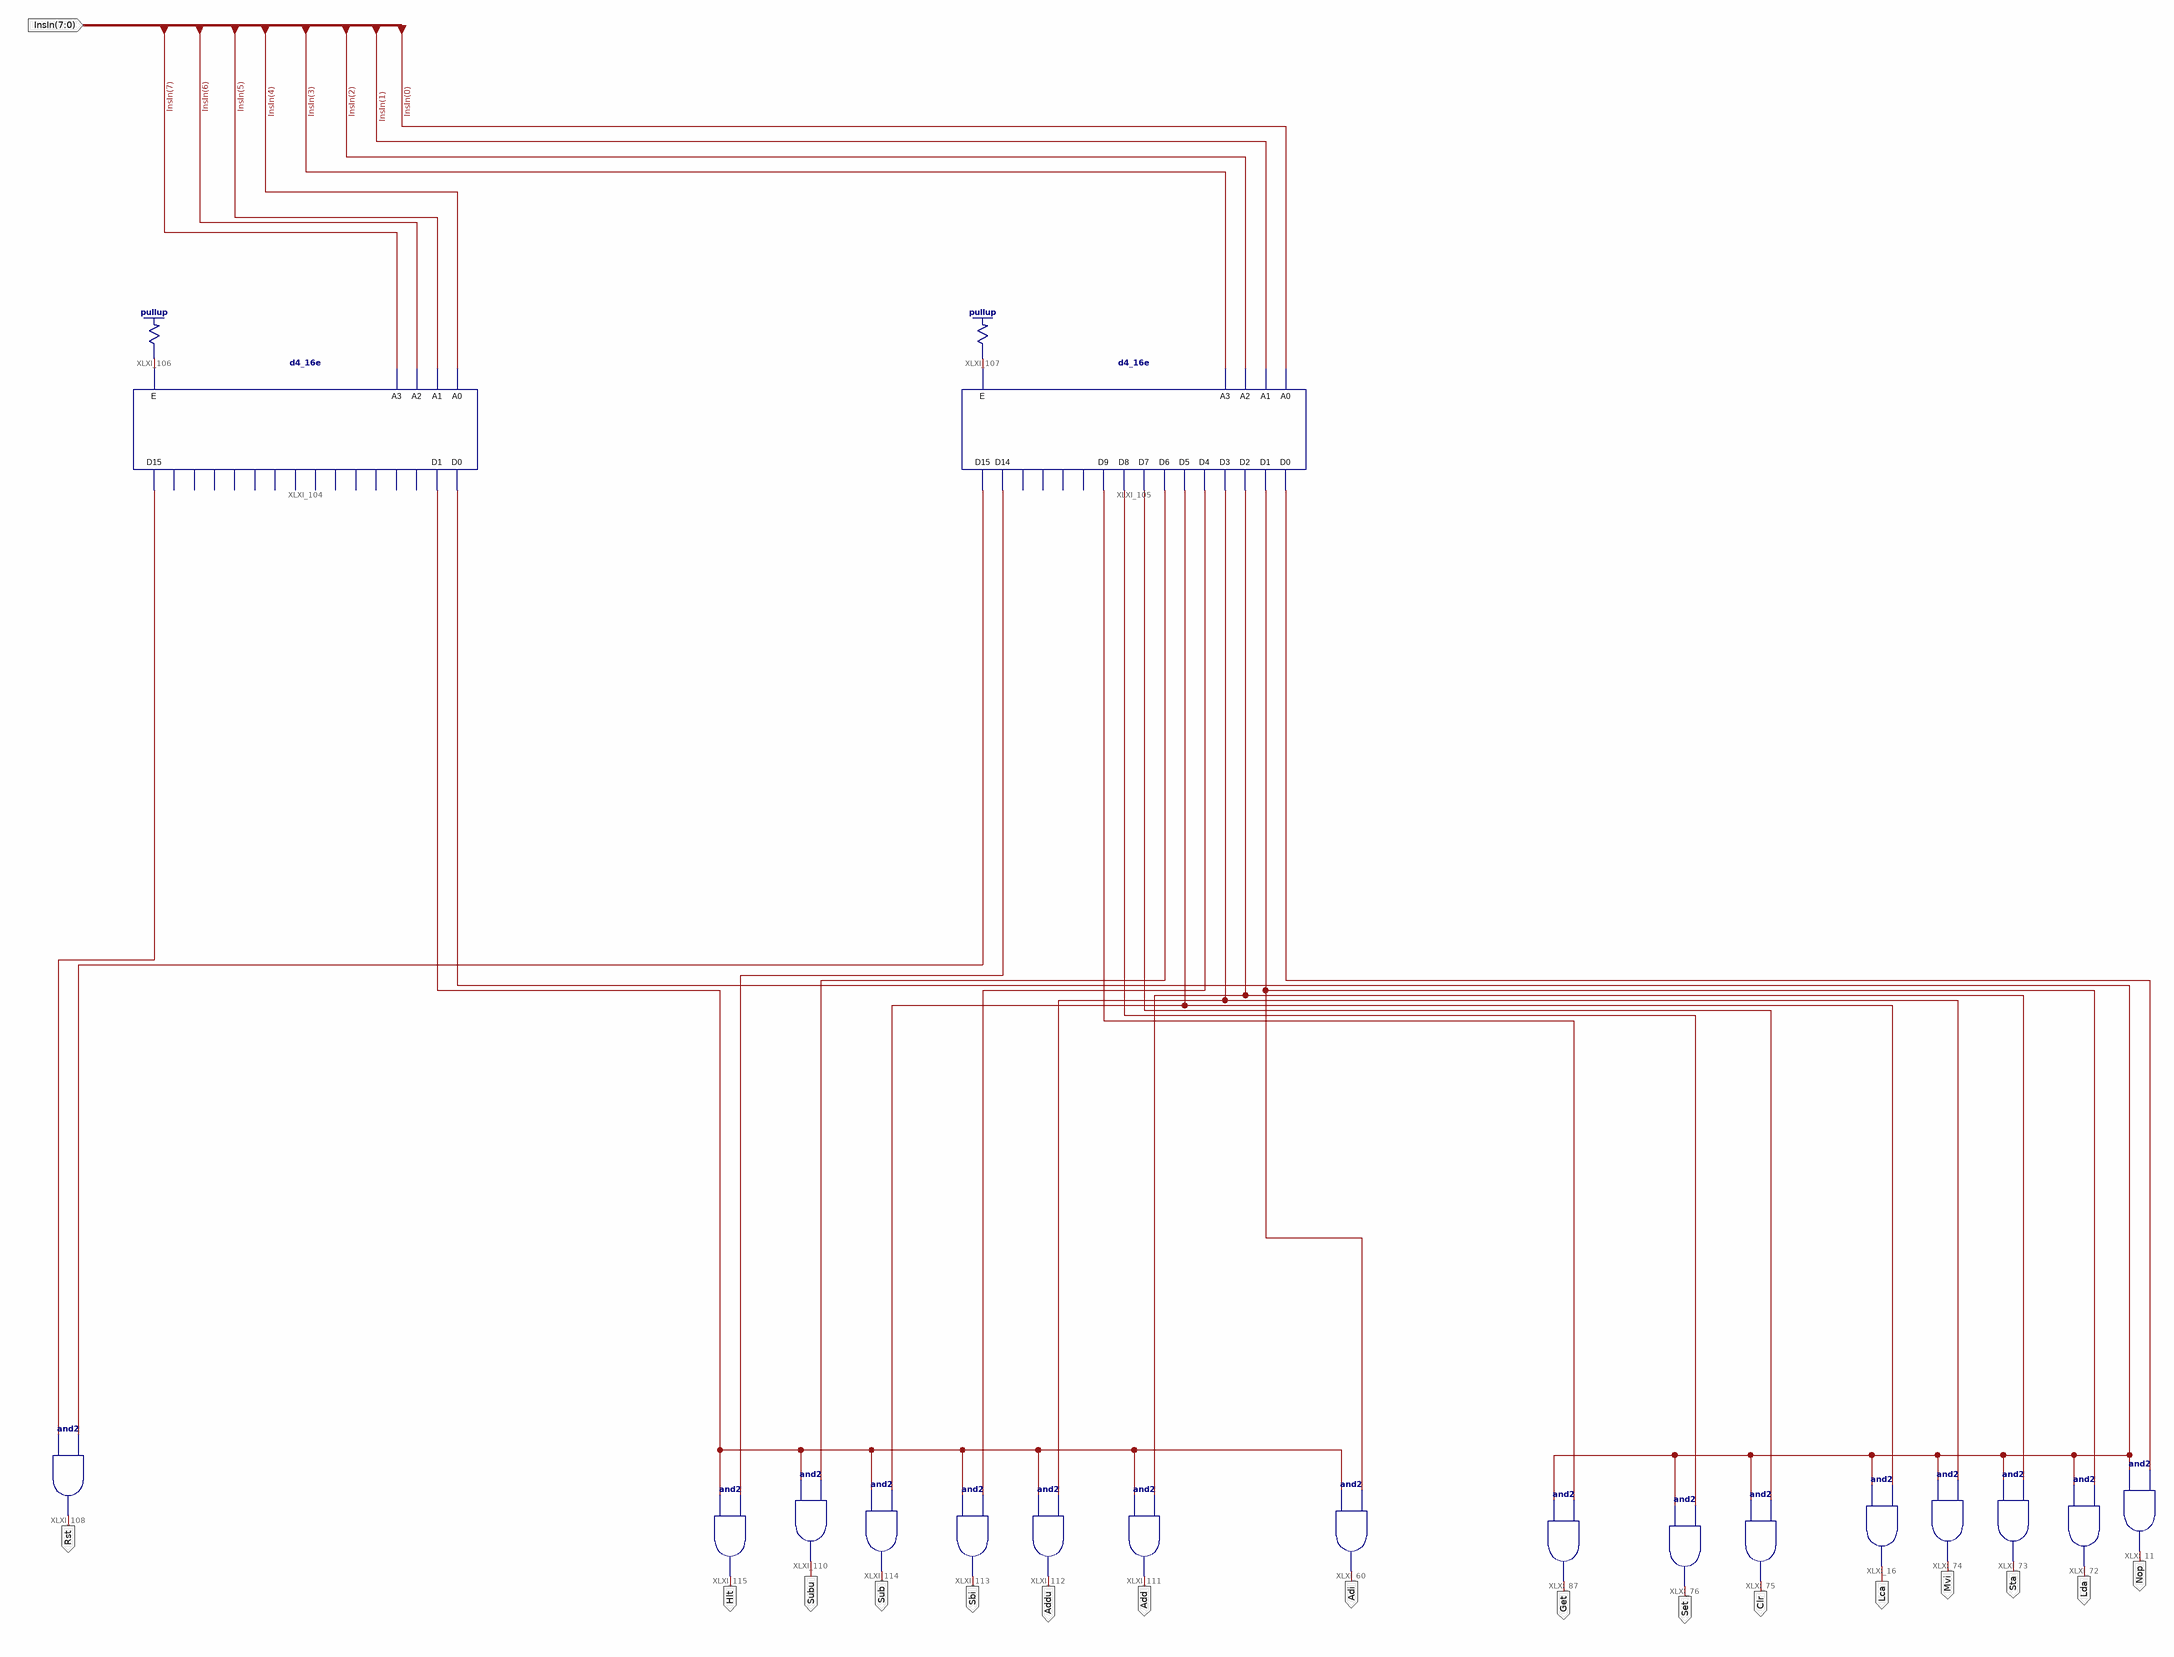
[diagram p0: schematic sheet 1]
// Xilinx ISE schematic InsDecoder.sch (spartan3e) as structural Verilog: 20 symbols, 17 ports
module InsDecoder (
  input  [7:0] InsIn,
  output Rst,
  output Nop,
  output Lca,
  output Lda,
  output Sta,
  output Mvi,
  output Clr,
  output Set,
  output Get,
  output Adi,
  output Add,
  output Addu,
  output Sbi,
  output Sub,
  output Hlt,
  output Subu
);

  wire XLXN_232, XLXN_233, XLXN_238, XLXN_239, XLXN_240, XLXN_241, XLXN_242, XLXN_243, XLXN_244, XLXN_245,
       XLXN_247, XLXN_248, XLXN_249, XLXN_257, XLXN_265, XLXN_266, XLXN_267;

  and XLXI_11 (Nop, XLXN_241, XLXN_240);
  and XLXI_72 (Lda, XLXN_241, XLXN_242);
  and XLXI_73 (Sta, XLXN_241, XLXN_243);
  and XLXI_74 (Mvi, XLXN_241, XLXN_244);
  and XLXI_16 (Lca, XLXN_241, XLXN_245);
  and XLXI_75 (Clr, XLXN_241, XLXN_247);
  and XLXI_76 (Set, XLXN_241, XLXN_248);
  and XLXI_87 (Get, XLXN_241, XLXN_249);
  d4_16e XLXI_104 (
    .A0(InsIn[4]), .A1(InsIn[5]), .A2(InsIn[6]), .A3(InsIn[7]), .E(XLXN_232), .D0(XLXN_241), .D1(XLXN_257),
    .D15(XLXN_238));  // open: D10, D11, D12, D13, D14, D2, D3, D4, D5, D6, D7, D8, D9
  d4_16e XLXI_105 (
    .A0(InsIn[0]), .A1(InsIn[1]), .A2(InsIn[2]), .A3(InsIn[3]), .E(XLXN_233), .D0(XLXN_240), .D1(XLXN_242),
    .D14(XLXN_267), .D15(XLXN_239), .D2(XLXN_243), .D3(XLXN_244), .D4(XLXN_265), .D5(XLXN_245),
    .D6(XLXN_266), .D7(XLXN_247), .D8(XLXN_248), .D9(XLXN_249));  // open: D10, D11, D12, D13
  \pullup  XLXI_106 (.O(XLXN_232));
  \pullup  XLXI_107 (.O(XLXN_233));
  and XLXI_108 (Rst, XLXN_238, XLXN_239);
  and XLXI_60 (Adi, XLXN_257, XLXN_242);
  and XLXI_111 (Add, XLXN_257, XLXN_243);
  and XLXI_112 (Addu, XLXN_257, XLXN_244);
  and XLXI_113 (Sbi, XLXN_257, XLXN_265);
  and XLXI_114 (Sub, XLXN_257, XLXN_245);
  and XLXI_115 (Hlt, XLXN_257, XLXN_267);
  and XLXI_110 (Subu, XLXN_257, XLXN_266);
endmodule
